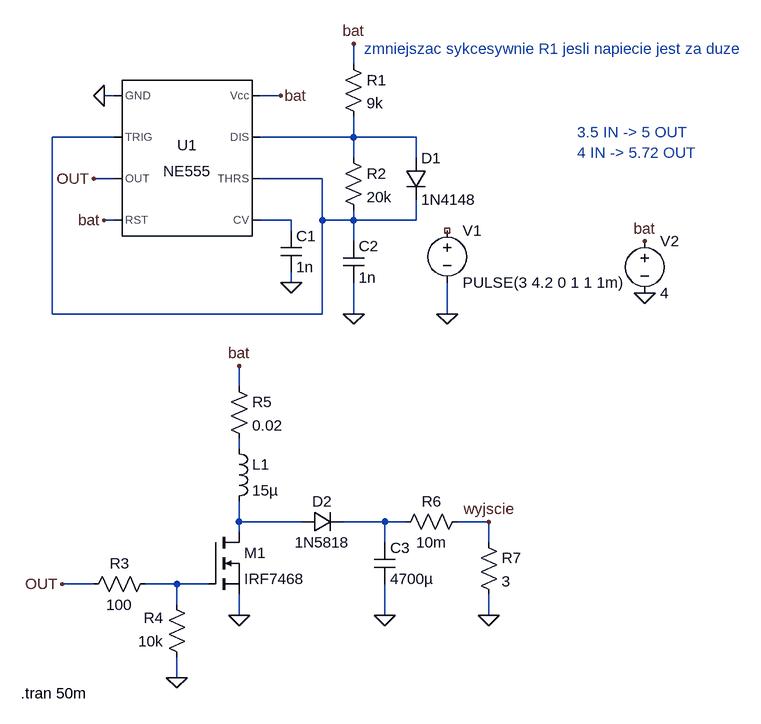
[diagram p0: schematic prund.asc]
prund.asc, the LTspice schematic file:
Version 4.1
SHEET 1 1200 680
WIRE 464 -320 464 -352
WIRE 96 -272 80 -272
WIRE 352 -272 320 -272
WIRE 96 -208 0 -208
WIRE 464 -208 464 -240
WIRE 464 -208 320 -208
WIRE 560 -208 464 -208
WIRE 464 -176 464 -208
WIRE 560 -176 560 -208
WIRE 96 -144 64 -144
WIRE 416 -144 320 -144
WIRE 96 -80 80 -80
WIRE 368 -80 320 -80
WIRE 416 -80 416 -144
WIRE 464 -80 464 -96
WIRE 464 -80 416 -80
WIRE 560 -80 560 -112
WIRE 560 -80 464 -80
WIRE 368 -64 368 -80
WIRE 464 -48 464 -80
WIRE 368 16 368 0
WIRE 0 64 0 -208
WIRE 416 64 416 -80
WIRE 416 64 0 64
WIRE 464 64 464 16
WIRE 608 64 608 16
WIRE 288 176 288 144
WIRE 288 272 288 256
WIRE 288 384 288 352
WIRE 384 384 288 384
WIRE 512 384 448 384
WIRE 544 384 512 384
WIRE 672 384 624 384
WIRE 288 400 288 384
WIRE 512 416 512 384
WIRE 672 416 672 384
WIRE 64 480 16 480
WIRE 192 480 144 480
WIRE 240 480 192 480
WIRE 192 512 192 480
WIRE 288 528 288 496
WIRE 512 528 512 480
WIRE 672 528 672 496
WIRE 192 624 192 592
FLAG 368 16 0
FLAG 464 64 0
FLAG 608 64 0
FLAG 352 -272 bat
FLAG 80 -80 bat
FLAG 80 -272 0
FLAG 464 -352 bat
FLAG 64 -144 OUT
FLAG 16 480 OUT
FLAG 192 624 0
FLAG 288 528 0
FLAG 288 144 bat
FLAG 512 528 0
FLAG 672 528 0
FLAG 912 32 0
FLAG 912 -48 bat
FLAG 672 384 wyjscie
SYMBOL Misc\\NE555 208 -176 R0
SYMATTR InstName U1
SYMBOL cap 352 -64 R0
SYMATTR InstName C1
SYMATTR Value 1n
SYMBOL res 448 -336 R0
SYMATTR InstName R1
SYMATTR Value 9k
SYMBOL res 448 -192 R0
SYMATTR InstName R2
SYMATTR Value 20k
SYMBOL cap 448 -48 R0
SYMATTR InstName C2
SYMATTR Value 1n
SYMBOL voltage 608 -80 R0
WINDOW 123 0 0 Left 0
WINDOW 39 0 0 Left 0
SYMATTR InstName V1
SYMATTR Value PULSE(3 4.2 0 1 1 1m)
SYMBOL nmos 240 400 R0
SYMATTR InstName M1
SYMATTR Value IRF7468
SYMBOL res 272 160 R0
SYMATTR InstName R5
SYMATTR Value 0.02
SYMBOL ind 272 256 R0
SYMATTR InstName L1
SYMATTR Value 15µ
SYMBOL cap 496 416 R0
SYMATTR InstName C3
SYMATTR Value 4700µ
SYMBOL res 656 400 R0
SYMATTR InstName R7
SYMATTR Value 3
SYMBOL diode 384 400 R270
WINDOW 0 32 32 VTop 2
WINDOW 3 0 32 VBottom 2
SYMATTR InstName D2
SYMATTR Value 1N5818
SYMBOL res 640 368 R90
WINDOW 0 0 56 VBottom 2
WINDOW 3 32 56 VTop 2
SYMATTR InstName R6
SYMATTR Value 10m
SYMBOL res 160 464 R90
WINDOW 0 0 56 VBottom 2
WINDOW 3 32 56 VTop 2
SYMATTR InstName R3
SYMATTR Value 100
SYMBOL res 208 608 R180
WINDOW 0 36 76 Left 2
WINDOW 3 36 40 Left 2
SYMATTR InstName R4
SYMATTR Value 10k
SYMBOL voltage 912 -64 R0
WINDOW 123 0 0 Left 0
WINDOW 39 0 0 Left 0
SYMATTR InstName V2
SYMATTR Value 4
SYMBOL diode 544 -176 R0
SYMATTR InstName D1
SYMATTR Value 1N4148
TEXT -48 648 Left 2 !.tran 50m
TEXT 480 -344 Left 2 ;zmniejszac sykcesywnie R1 jesli napiecie jest za duze
TEXT 808 -216 Left 2 ;3.5 IN -> 5 OUT
TEXT 808 -184 Left 2 ;4 IN -> 5.72 OUT

The netlist it stands for:
* prund.asc
X§U1 0 N001 OUT bat N003 N001 N002 bat NE555  ; pins GND TRIG OUT RST CV THRS DIS Vcc
C1 N003 0 1n
R1 bat N002 9k
R2 N002 N001 20k
C2 N001 0 1n
V1 NC_01 0 PULSE(3 4.2 0 1 1 1m)
M1 N005 N007 0 0 IRF7468
R5 bat N004 0.02
L1 N004 N005 15µ
C3 N006 0 4700µ
R7 wyjscie 0 3
D2 N005 N006 1N5818
R6 wyjscie N006 10m
R3 N007 OUT 100
R4 0 N007 10k
V2 bat 0 4
D1 N002 N001 1N4148
.model D D
.lib standard.dio
.model NMOS NMOS
.model PMOS PMOS
.lib standard.mos
.tran 50m
* zmniejszac sykcesywnie R1 jesli napiecie jest za duze
* 3.5 IN -> 5 OUT
* 4 IN -> 5.72 OUT
.lib NE555.sub
.backanno
.end